# Altium schematic sheet HoloCubicCh340nV02_220109.SchDoc
size A4
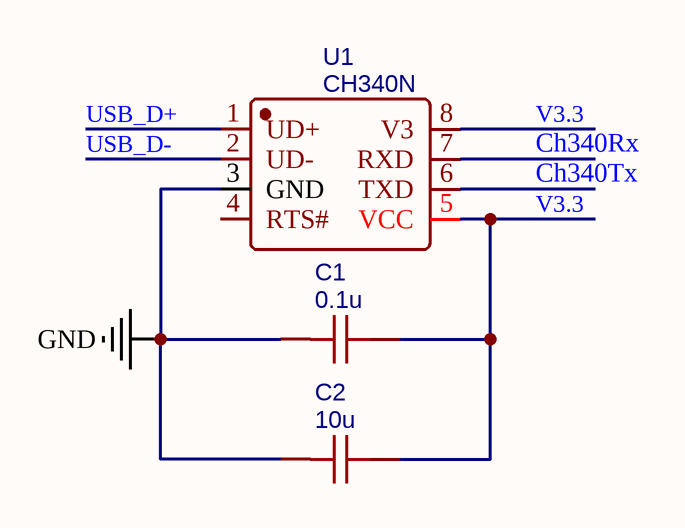
[diagram p0: HoloCubicCh340nV02_220109.SchDoc]

## Parts
C1  0.1u  [C0603]
C2  10u  [C0603]
U1  CH340N  [SOP-8_L5.0-W4.0-P1.27-LS6.0-BL]

## Nets
GND: C1.2 C2.2 U1.3(GND)
Ch340Rx: U1.7(RXD)
Ch340Tx: U1.6(TXD)
USB_D+: U1.1(UD+)
USB_D-: U1.2(UD-)
V3.3: C1.1 C2.1 U1.5(VCC) U1.8(V3)

Not connected (* = marked no-connect by the designer): U1 4(RTS#)

## Library data of the parts
C1 = 0.1u: nameAlias: Value(F); Contributor: LCEDA_Lib; spicePre: C; spiceSymbolName: C_0603_US
C2 = 10u: nameAlias: Value(F); Contributor: LCEDA_Lib; spicePre: C; spiceSymbolName: C_0603_US
U1 = CH340N: BOM_Manufacturer: WCH(Jiangsu Qin Heng); Contributor: LCSC; BOM_Supplier: LCSC; BOM_Supplier Part: C506813; BOM_Manufacturer Part: CH340N; BOM_JLCPCB Part Class: Extended Part; spicePre: U; spiceSymbolName: CH340N